# EAGLE design OnePinKeypadv1.1.0 (EAGLE 9.1.3)
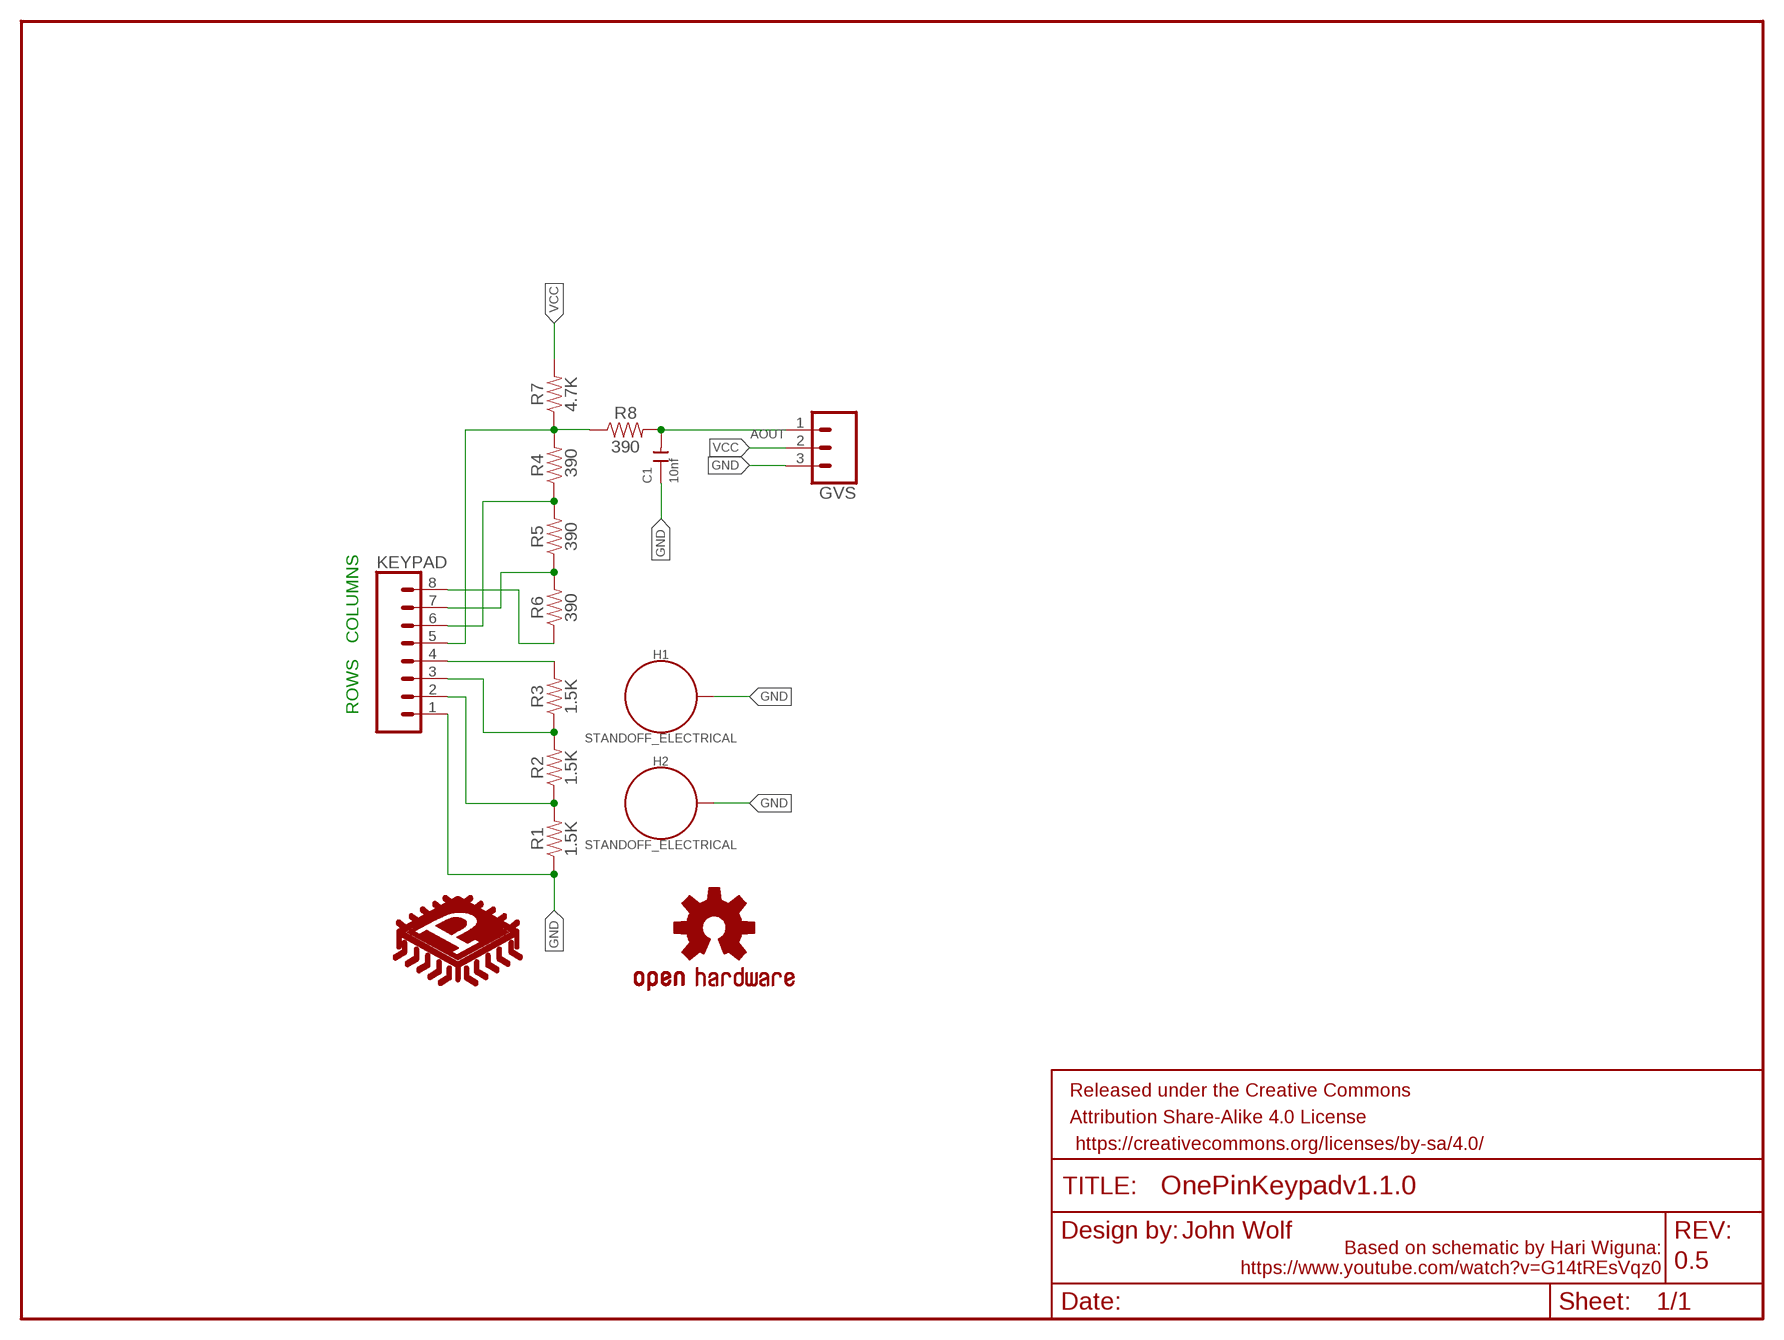
[diagram p0: schematic, sheet 1]

## Parts
C1  10nf  CERAMIC-100NF-50V-10%-X7R(0805)  [C0805]
FRAME1  FRAME-LETTER  [CREATIVE_COMMONS]
GVS  CONN_03  [1X03]
H1  STANDOFF_ELECTRICAL  [STANDOFF-ELECTRICAL]
H2  STANDOFF_ELECTRICAL  [STANDOFF-ELECTRICAL]
KEYPAD  CONN_08"  [1X08]
LOGO1  OSHW-LOGOS  [OSHW-LOGO-S]
R1  1.5K  RESISTOR0805  [0805]
R2  1.5K  RESISTOR0805  [0805]
R3  1.5K  RESISTOR0805  [0805]
R4  390  RESISTOR0805  [0805]
R5  390  RESISTOR0805  [0805]
R6  390  RESISTOR0805  [0805]
R7  4.7K  RESISTOR0805  [0805]
R8  390  RESISTOR0805  [0805]
U$2  LOGO_V1  [LOGO_V1]

## Nets
AOUT: C1.2 GVS.1 R8.2
COL1: KEYPAD.5 R4.2 R7.1 R8.1
COL2: KEYPAD.6 R4.1 R5.2
COL3: KEYPAD.7 R5.1 R6.2
COL4: KEYPAD.8 R6.1
GND: C1.1 GVS.3 H1.P1 H2.P1 KEYPAD.1 R1.1
ROW2: KEYPAD.2 R1.2 R2.1
ROW3: KEYPAD.3 R2.2 R3.1
ROW4: KEYPAD.4 R3.2
VCC: GVS.2 R7.2

## Notes on the sheet
- COLUMNS
- ROWS
- John Wolf
- 0.5
- Based on schematic by Hari Wiguna:
  https://www.youtube.com/watch?v=G14tREsVqz0

## Library data of the parts
C1 = Seeed-Capacitor:CERAMIC-100NF-50V-10%-X7R(0805): 302010165; MPN: CC0805KRX7R9BB104; VALUE: 100nf
FRAME1 = SparkFun-Aesthetics:FRAME-LETTER: Schematic Frame - Letter Standard 8.5x11 US Letter frame
GVS = SparkFun-Connectors:CONN_03: Multi connection point. Often used as Generic Header-pin footprint for 0.1 inch spaced/style header connections On any of the 0.1 inch spaced packages, you can populate with these: Break Away Headers - Straight <https://www.sparkfun.com/products/116> (PRT-00116) Break Away Male Headers - Right Angle <https://www.sparkfun.com/products/553> (PRT-00553) Female Headers <https://www.sparkfun.com/products/115> (PRT-00115) Break Away Headers - Machine Pin <https://www.sparkfun.com/products/117> (PRT-00117) Break Away Female Headers - Swiss Machine Pin <https://www.sparkfun.com/products/743> (PRT-00743) Stackable Header - 3 Pin (Female, 0.1") <https://www.sparkfun.com/products/13875> (PRT-13875) For SCREWTERMINALS and SPRING TERMINALS visit here: Screw Terimnals on SparkFun.com <https://www.sparkfun.com/search/results?term=Screw+Terminals> (5mm/3.5mm/2.54mm spacing) This device is also useful as a general connection point to wire up your design to another part of your project. Our various solder wires solder well into these plated through hole pads. Hook-Up Wire - Assortment (Stranded, 22 AWG) <https://www.sparkfun.com/products/11375> (PRT-11375) Hook-Up Wire - Assortment (Solid Core, 22 AWG) <https://www.sparkfun.com/products/11367> (PRT-11367) View the entire wire category on our website here <https://www.sparkfun.com/categories/141> Special notes: Molex polarized connector foot print use with SKU : PRT-08232 with associated crimp pins and housings.
H1 H2 = SparkFun-Hardware:STANDOFF_ELECTRICAL: Stand Off Drill holes with an electrical connection. For example, use these to ground your board to a chassis. Example SparkFun Products Screw - Phillips Head (1/4", 4-40, 10 pack) <https://www.sparkfun.com/products/10453> (PRT-10453) Screw - Phillips Head (1/2", 4-40, 10 pack) <https://www.sparkfun.com/products/10452> (PRT-10452) Screw - Phillips Head (3/4", 4-40, 10 pack) <https://www.sparkfun.com/products/10451> (PRT-10451) Screw - Phillips Head (1", 4-40, 10 pack) <https://www.sparkfun.com/products/10450> (PRT-10450)
KEYPAD = SparkFun-Connectors:CONN_08: Multi connection point. Often used as Generic Header-pin footprint for 0.1 inch spaced/style header connections On any of the 0.1 inch spaced packages, you can populate with these: Break Away Headers - Straight <https://www.sparkfun.com/products/116> (PRT-00116) Break Away Male Headers - Right Angle <https://www.sparkfun.com/products/553> (PRT-00553) Female Headers <https://www.sparkfun.com/products/115> (PRT-00115) Break Away Headers - Machine Pin <https://www.sparkfun.com/products/117> (PRT-00117) Break Away Female Headers - Swiss Machine Pin <https://www.sparkfun.com/products/743> (PRT-00743) Arduino Stackable Header - 8 Pin <https://www.sparkfun.com/products/9279> (PRT-09279) For SCREWTERMINALS and SPRING TERMINALS visit here: Screw Terimnals on SparkFun.com <https://www.sparkfun.com/search/results?term=Screw+Terminals> (5mm/3.5mm/2.54mm spacing) This device is also useful as a general connection point to wire up your design to another part of your project. Our various solder wires solder well into these plated through hole pads. Hook-Up Wire - Assortment (Stranded, 22 AWG) <https://www.sparkfun.com/products/11375> (PRT-11375) Hook-Up Wire - Assortment (Solid Core, 22 AWG) <https://www.sparkfun.com/products/11367> (PRT-11367) View the entire wire category on our website here <https://www.sparkfun.com/categories/141> Special notes: Molex polarized connector foot print use with SKU : PRT-08231 with associated crimp pins and housings. 1MM SMD Version SKU: PRT-10208 NOTES ON THE VARIANTS LOCK and LOCK_LONGPADS... This footprint was designed to help hold the alignment of a through-hole component (i.e. 6-pin header) while soldering it into place. You may notice that each hole has been shifted either up or down by 0.005 of an inch from it's more standard position (which is a perfectly straight line). This slight alteration caused the pins (the squares in the middle) to touch the edges of the holes. Because they are alternating, it causes a "brace" to hold the component in place. 0.005 has proven to be the perfect amount of "off-center" position when using our standard breakaway headers. Although looks a little odd when you look at the bare footprint, once you have a header in there, the alteration is very hard to notice. Also,if you push a header all the way into place, it is covered up entirely on the bottom side.; PROD_ID: CONN-08438
LOGO1 = SparkFun-Aesthetics:OSHW-LOGO: Open-Source Hardware (OSHW) Logo This logo indicates the piece of hardware it is found on incorporates a OSHW license and/or adheres to the definition of open source hardware found here: http://freedomdefined.org/OSHW
R1-R8 = SparkFun-Resistors:RESISTOR: Generic Resistor Package
U$2 = Progetto:LOGO_V1: Progetto Logo: Logo for use on Progetto PCBs. Note: Footprint defaults to an orientation for placement on the bottom silkscreen of boards. If you want to place it on the top silkscreen simply flip it in the board editor.

## Board
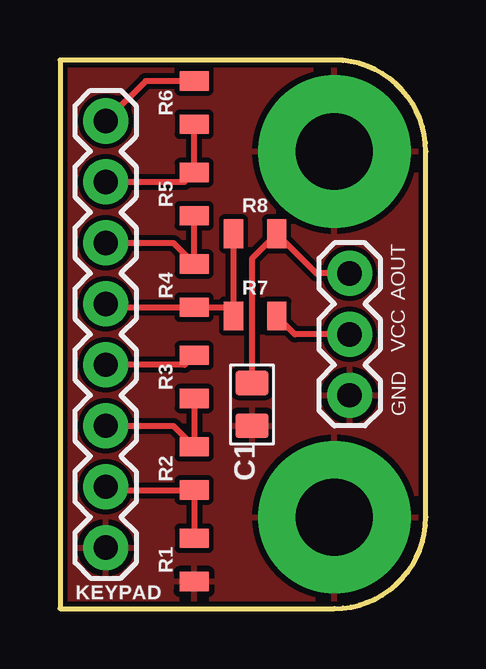
[diagram p1: board, top side]
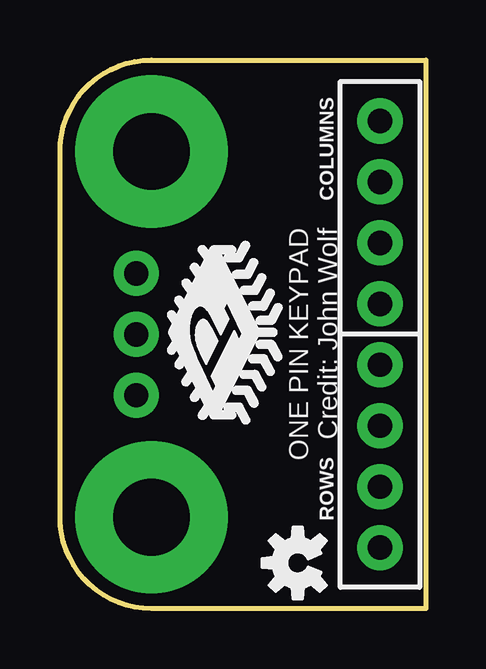
[diagram p2: board, bottom side, seen from below]

Size 15.24 x 22.86 mm. Coordinates in mm from the lower left corner, seen from the top.
Outline: 0,0 11.43,0 arc90 15.24,3.81 15.24,19.05 arc90 11.43,22.86 0,22.86 0,0
Copper layers (1*16): Top 0.035mm / dielectric 1.5mm / Bottom 0.035mm
Design rules "SparkFun": minimum track width 8mil, minimum drill 20mil, track to track 8mil, track to pad 8mil, pad to pad 8mil, via to via 8mil, smd to smd 8mil, copper to edge 8mil, drill to drill 8mil, minimum pad ring 12mil, minimum via ring 10mil, stop-mask expansion 4mil, vias tented up to drill 20mil, thermal gap 10mil

### Footprints (pad centres in the part's own frame; a part is rotated, then mirrored left to right if it is on the bottom)
C0805 = smd 1.397 x 1.016: 1 0,0.889; 2 0,-0.889
1X03 = drill 1.016 pad 1.88: 1 0,0; 2 2.54,0; 3 5.08,0
STANDOFF-ELECTRICAL = drill 3.2 pad 6.35: P1 0,0
1X08 = drill 1.016 pad 1.88: 1 0,0; 2 2.54,0; 3 5.08,0; 4 7.62,0; 5 10.16,0; 6 12.7,0; 7 15.24,0; 8 17.78,0
0805 = smd 0.8 x 1.2: 1 -0.9,0; 2 0.9,0

### Placement (x,y rotation side)
C1  8,8.51 180 top
FRAME1  -13.97,-8.89 0 top  (outside the outline)
GVS  12.06,13.97 270 top
H1  11.43,3.81 0 top
H2  11.43,19.05 0 top
KEYPAD  1.91,2.54 90 top
LOGO1  5.33,1.91 90 bottom
R1  5.59,2.03 90 top
R2  5.59,5.84 90 top
R3  5.59,9.65 90 top
R4  5.59,13.46 270 top
R5  5.59,17.27 270 top
R6  5.59,21.08 270 top
R7  8.13,12.19 0 top
R8  8.13,15.62 0 top
U$2  5.97,15.37 270 top

### Tracks (layer width: path | path; a pad name or v marks a point on that pad's centre or on a via)
AOUT
  Top 0.254: C1.2 8,14.59 R8.2 10.68,13.97 GVS.1
COL1
  Top 0.203: 6.86,12.56 R7.1
  Top 0.254: R8.1 R7.1 | 6.86,12.56 R4.2 2.04,12.56 KEYPAD.5
COL2
  Top 0.254: R5.2 R4.1 4.71,15.24 KEYPAD.6
COL3
  Top 0.254: R6.2 R5.1 5.2,17.78 KEYPAD.7
COL4
  Top 0.254: R6.1 3.57,21.98 KEYPAD.8
GND
  pour Top: 0,22.86 0,0 11.43,0 arc90 15.24,3.81 15.24,19.05 arc90 11.43,22.86
ROW2
  Top 0.254: R1.2 R2.1 2.04,4.94 KEYPAD.2
ROW3
  Top 0.254: R3.1 R2.2 4.71,7.62 KEYPAD.3
ROW4
  Top 0.254: R3.2 5.2,10.16 KEYPAD.4
VCC
  Top 0.254: GVS.2 9.79,11.43 R7.2

### Text on the board
tPlace: Progetto
tNames: AOUT | VCC | GND
bNames: COLUMNS | ONE PIN KEYPAD / Credit: John Wolf | ROWS